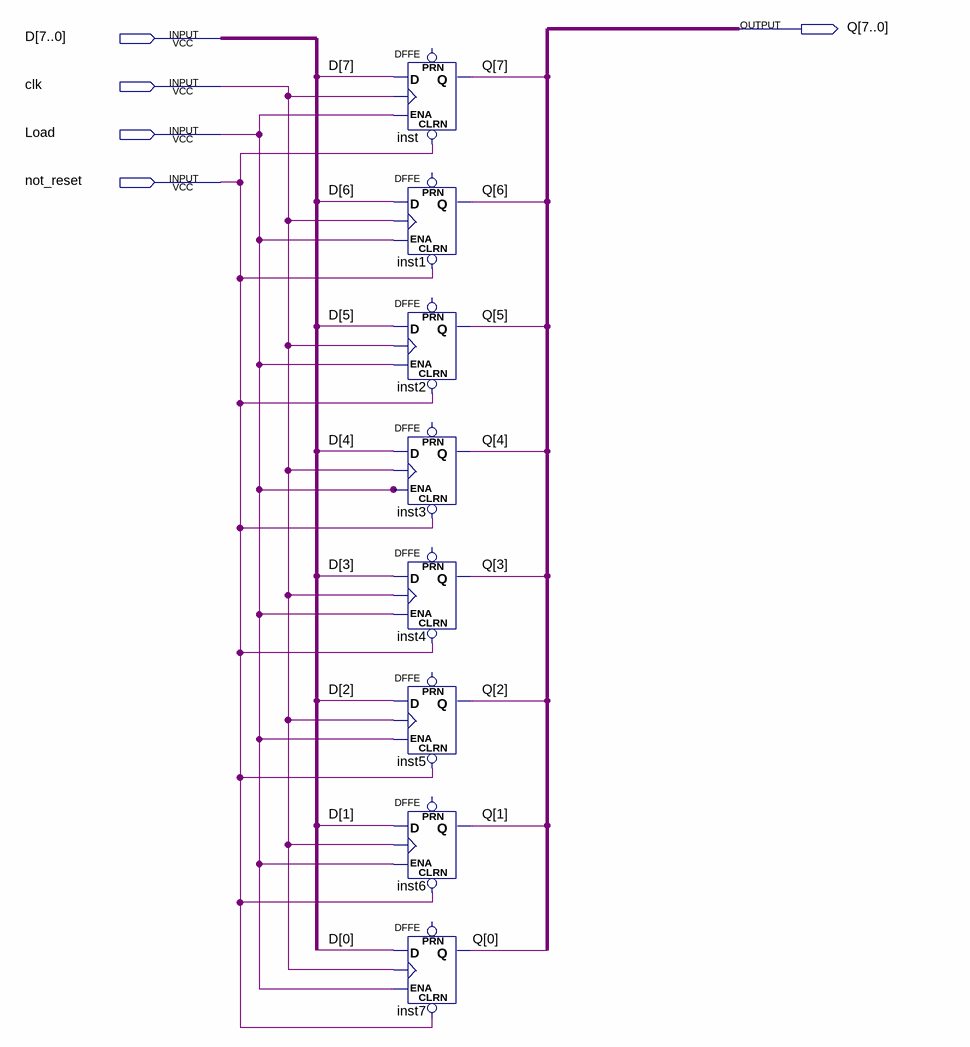
[diagram p0: schematic sheet]
// Quartus schematic reg_8bit.bdf as structural Verilog: 8 symbols, 5 pins
module reg_8bit (
  input  [7:0] D,
  input  clk,
  input  Load,
  input  not_reset,
  output [7:0] Q
);

  DFFE inst (.CLRN(not_reset), .D(D[7]), .CLK(clk), .ENA(Load), .Q(Q[7]));  // open: PRN
  DFFE inst1 (.CLRN(not_reset), .D(D[6]), .CLK(clk), .ENA(Load), .Q(Q[6]));  // open: PRN
  DFFE inst2 (.CLRN(not_reset), .D(D[5]), .CLK(clk), .ENA(Load), .Q(Q[5]));  // open: PRN
  DFFE inst3 (.CLRN(not_reset), .D(D[4]), .CLK(clk), .ENA(Load), .Q(Q[4]));  // open: PRN
  DFFE inst4 (.CLRN(not_reset), .D(D[3]), .CLK(clk), .ENA(Load), .Q(Q[3]));  // open: PRN
  DFFE inst5 (.CLRN(not_reset), .D(D[2]), .CLK(clk), .ENA(Load), .Q(Q[2]));  // open: PRN
  DFFE inst6 (.CLRN(not_reset), .D(D[1]), .CLK(clk), .ENA(Load), .Q(Q[1]));  // open: PRN
  DFFE inst7 (.CLRN(not_reset), .D(D[0]), .CLK(clk), .ENA(Load), .Q(Q[0]));  // open: PRN
endmodule
